# Altium schematic sheet 05 - Connector.SchDoc
size A4; SheetNumber: 4; SheetTotal: 4; SchemaTitle: Overview
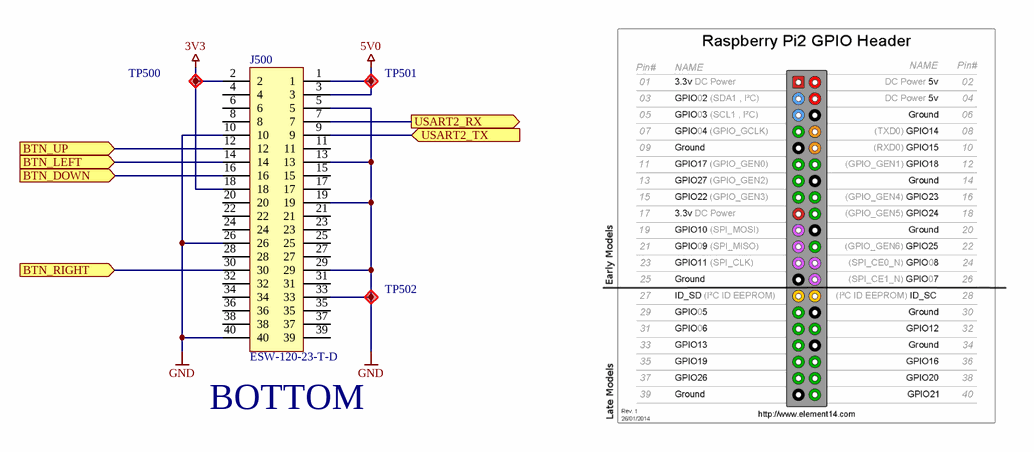
[diagram p0: 05 - Connector.SchDoc]

## Parts
J500  ESW-120-23-T-D  [ESW-120-23-T-D-Footprint-1]
TP500  Testpoint  [Testpoint SMD 1.5mm]  (value not drawn)  (no BOM)
TP501  Testpoint  [Testpoint SMD 1.5mm]  (value not drawn)  (no BOM)
TP502  Testpoint  [Testpoint SMD 1.5mm]  (value not drawn)  (no BOM)

## Ports
BTN_DOWN (in), BTN_LEFT (in), BTN_RIGHT (in), BTN_UP (in), USART2_RX (out), USART2_TX (in)

## Nets
3V3: J500.2 J500.18 TP500.1
5V0: J500.1 J500.3 TP501.1
GND: J500.5 J500.10 J500.13 J500.19 J500.26 J500.29 J500.33 J500.40 TP502.1
BTN_DOWN: J500.16 ; port BTN_DOWN
BTN_LEFT: J500.14 ; port BTN_LEFT
BTN_RIGHT: J500.30 ; port BTN_RIGHT
BTN_UP: J500.12 ; port BTN_UP
USART2_RX: J500.7 ; port USART2_RX
USART2_TX: J500.9 ; port USART2_TX

Not connected (* = marked no-connect by the designer): J500 4 6 8 11 15 17 20 21 22 23 24 25 27 28 31 32 34 35 36 37 38 39

## Notes on the sheet
- (near J500) BOTTOM
- Schema Title:
- Project:
- Revision:
- Author:
- PCB Name:
- Date:
- Time:
- Sheet:
- of
- Doc Name:
- A4

## Library data of the parts
J500 = CMP-02021-01: 40 Position Elevated Socket Connector 0.100" (2.54mm) Through Hole Tin; Manufacturer: Samtec Inc.; Manufacturer Part Number: ESW-120-23-T-D; ComponentLink1Description: Datasheet; ComponentLink1URL: https://suddendocs.samtec.com/prints/esw-1xx-xx-x-x-xx-xx-mkt.pdf; Supplier Part Number 1: 2031-ESW-120-23-T-D-ND; Supplier 1: Digi-Key
TP500-TP502 = CMP-00246-13: Testpoint various footprints